# Altium project WorkLamp.PrjPCB
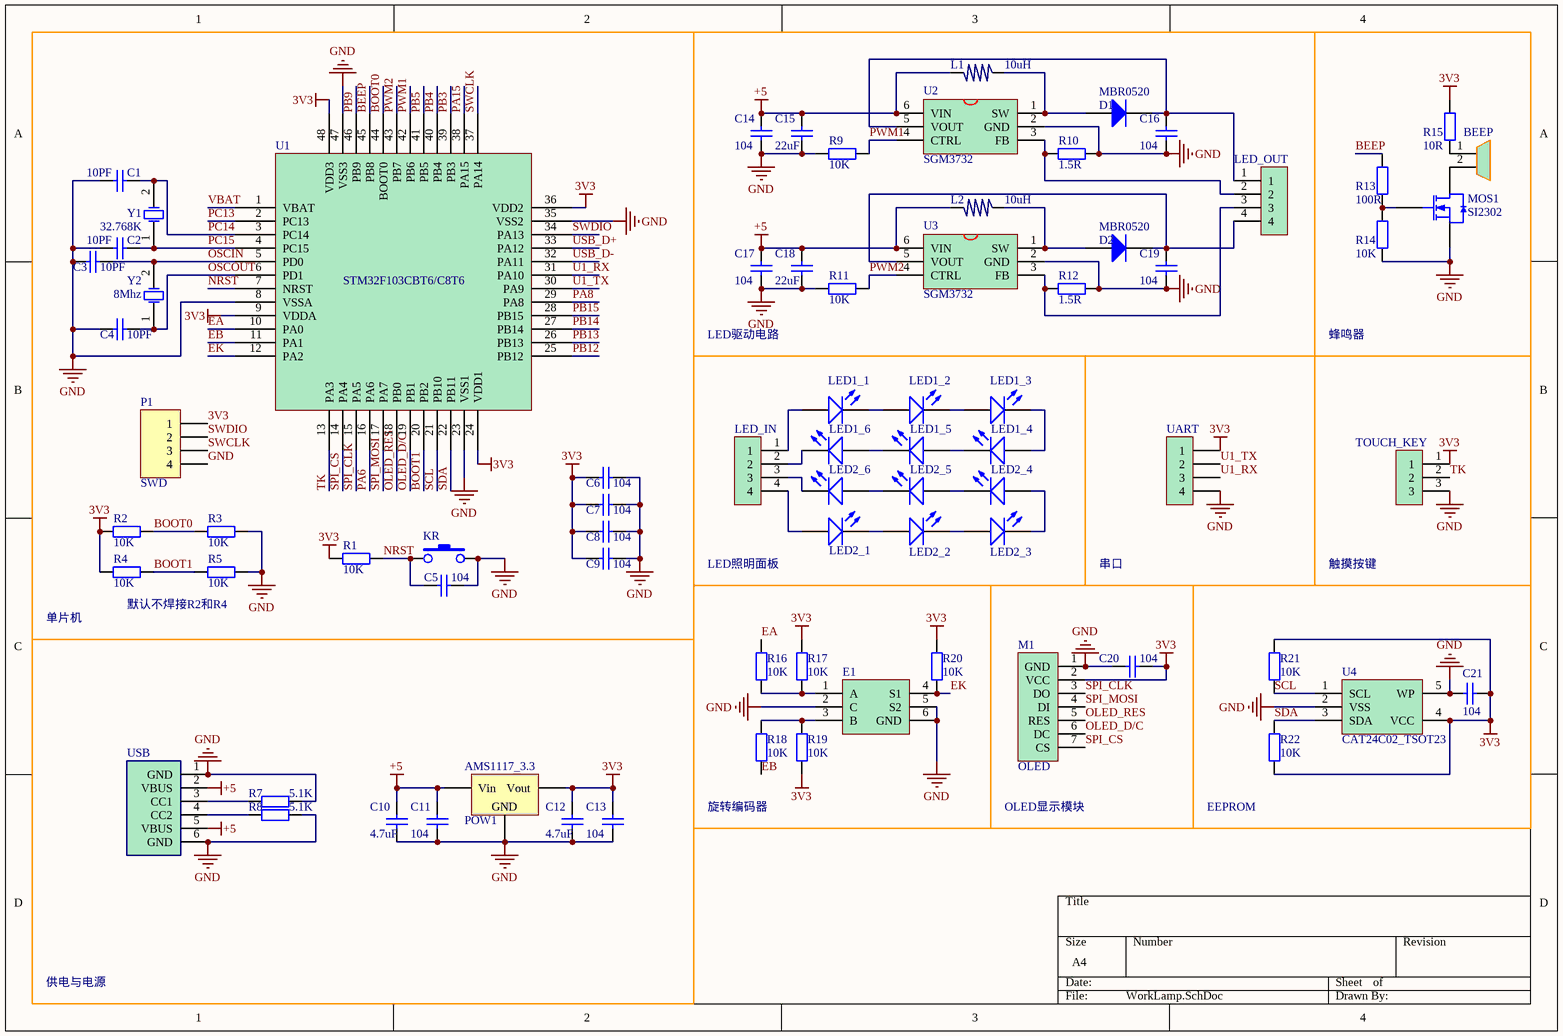
[diagram p0: WorkLamp.SchDoc]
1 sheet, 76 parts. Net scope: global (net labels, ports and power ports of the same name join across sheets).
Board files: WorkLamp.PcbDoc, WorkLamp_control.PcbDoc, WorkLamp_led.PcbDoc

## Sheet WorkLamp.SchDoc
size A4

### Parts
BEEP  BEEP_5020_SMT  [BEEP_5020_SMT]  (value not drawn)
C1  10PF  [0603_C]
C2  10PF  [0603_C]
C3  10PF  [0603_C]
C4  10PF  [0603_C]
C5  104  [0603_C]
C6  104  [0603_C]
C7  104  [0603_C]
C8  104  [0603_C]
C9  104  [0603_C]
C10  4.7uF  [0603_C]
C11  104  [0603_C]
C12  4.7uF  [0603_C]
C13  104  [0603_C]
C14  104  [0603_C]
C15  22uF  [0603_C]
C16  104  [0603_C]
C17  104  [0603_C]
C18  22uF  [0603_C]
C19  104  [0603_C]
C20  104  [0603_C]
C21  104  [0603_C]
D1  MBR0520  [SOD_123]
D2  MBR0520  [SOD_123]
E1  ENCODER  [ENCODER_EC11_DIP]  (value not drawn)
KR  KEY_SMT  [KEY_SMT]  (value not drawn)
L1  10uH  [0630_L]
L2  10uH  [0630_L]
LED1_1  LED_5730  [LED_5730]  (value not drawn)
LED1_2  LED_5730  [LED_5730]  (value not drawn)
LED1_3  LED_5730  [LED_5730]  (value not drawn)
LED1_4  LED_5730  [LED_5730]  (value not drawn)
LED1_5  LED_5730  [LED_5730]  (value not drawn)
LED1_6  LED_5730  [LED_5730]  (value not drawn)
LED2_1  LED_5730  [LED_5730]  (value not drawn)
LED2_2  LED_5730  [LED_5730]  (value not drawn)
LED2_3  LED_5730  [LED_5730]  (value not drawn)
LED2_4  LED_5730  [LED_5730]  (value not drawn)
LED2_5  LED_5730  [LED_5730]  (value not drawn)
LED2_6  LED_5730  [LED_5730]  (value not drawn)
LED_IN  SH1.25mm_4P  [SH1.25MM_4P]  (value not drawn)
LED_OUT  SH1.25mm_4P  [SH1.25MM_4P]  (value not drawn)
M1  OLED  [OLED_0.96_SPI]
MOS1  SI2302  [SOT23]
P1  SWD  [HDR1X4]
POW1  AMS1117_3.3  [SOT223]
R1  10K  [0603_R]
R2  10K  [0603_R]
R3  10K  [0603_R]
R4  10K  [0603_R]
R5  10K  [0603_R]
R7  5.1K  [0603_R]
R8  5.1K  [0603_R]
R9  10K  [0603_R]
R10  1.5R  [0603_R]
R11  10K  [0603_R]
R12  1.5R  [0603_R]
R13  100R  [0603_R]
R14  10K  [0603_R]
R15  10R  [0603_R]
R16  10K  [0603_R]
R17  10K  [0603_R]
R18  10K  [0603_R]
R19  10K  [0603_R]
R20  10K  [0603_R]
R21  10K  [0603_R]
R22  10K  [0603_R]
TOUCH_KEY  SH1.25mm_3P  [SH1.25mm_3P]  (value not drawn)
U1  STM32F103C8T6  [LQFP48]  (value not drawn)
U2  SGM3732  [TSOT_23_6]
U3  SGM3732  [TSOT_23_6]
U4  CAT24C02_TSOT23  [SOT_23_5]
UART  Header_2.54_4P  [HDR1_4P]  (value not drawn)
USB  USB_C_6P_SMT_S1  [USB_C_6PIN_SMT_S1]  (value not drawn)
Y1  32.768K  [XTAL_32.768_3215_2]
Y2  8Mhz  [XTAL_5032_2]

### Nets
3V3: C6.2 C7.2 C8.2 C9.2 C12.1 C13.1 C20.1 C21.1 M1.2(VCC) P1.1 POW1.2(Vout) R1.1 R2.2 R4.2 R15.1 R17.2 R19.1 R20.2 R21.2 R22.1 TOUCH_KEY.1 U1.9(VDDA) U1.24(VDD1) U1.36(VDD2) U1.48(VDD3) U4.4(VCC) UART.1
+5: C10.1 C11.1 C14.1 C15.1 C17.1 C18.1 L1.2 L2.2 POW1.3(Vin) U2.6(VIN) U3.6(VIN) USB.2(VBUS) USB.5(VBUS)
GND: C1.1 C2.1 C3.1 C4.1 C5.1 C6.1 C7.1 C8.1 C9.1 C10.2 C11.2 C12.2 C13.2 C14.2 C15.2 C16.2 C17.2 C18.2 C19.2 C20.2 C21.2 E1.2(C) E1.5(S2) E1.6(GND) KR.2 M1.1(GND) MOS1.2(S) P1.4 POW1.1(GND) R3.1 R5.1 R7.1 R8.1 R9.1 R10.1 R11.1 R12.1 R14.1 TOUCH_KEY.3 U1.8(VSSA) U1.23(VSS1) U1.35(VSS2) U1.47(VSS3) U2.2(GND) U3.2(GND) U4.2(VSS) U4.5(WP) UART.4 USB.1(GND) USB.6(GND)
BEEP: R13.2 U1.45(PB8)
BOOT0: R2.1 R3.2 U1.44(BOOT0)
BOOT1: R4.1 R5.2 U1.20(PB2)
EA: R16.2 U1.10(PA0)
EB: R18.1 U1.11(PA1)
EK: E1.4(S1) R20.1 U1.12(PA2)
NRST: C5.2 KR.1 R1.2 U1.7(NRST)
OLED_D/C: M1.6(DC) U1.19(PB1)
OLED_RES: M1.5(RES) U1.18(PB0)
OSCIN: C3.2 U1.5(PD0) Y2.2(OSC2)
OSCOUT: C4.2 U1.6(PD1) Y2.1(OSC1)
PA6: U1.16(PA6)
PA8: U1.29(PA8)
PA15: U1.38(PA15)
PB3: U1.39(PB3)
PB4: U1.40(PB4)
PB5: U1.41(PB5)
PB9: U1.46(PB9)
PB12: U1.25(PB12)
PB13: U1.26(PB13)
PB14: U1.27(PB14)
PB15: U1.28(PB15)
PC13: U1.2(PC13)
PC14: C1.2 U1.3(PC14) Y1.2(OSC2)
PC15: C2.2 U1.4(PC15) Y1.1(OSC1)
PWM1: R9.2 U1.42(PB6) U2.4(CTRL)
PWM2: R11.2 U1.43(PB7) U3.4(CTRL)
SCL: R21.1 U1.21(PB10) U4.1(SCL)
SDA: R22.2 U1.22(PB11) U4.3(SDA)
SPI_CLK: M1.3(DO) U1.15(PA5)
SPI_CS: M1.7(CS) U1.14(PA4)
SPI_MOSI: M1.4(DI) U1.17(PA7)
SWCLK: P1.3 U1.37(PA14)
SWDIO: P1.2 U1.34(PA13)
TK: TOUCH_KEY.2 U1.13(PA3)
U1_RX: U1.31(PA10) UART.3
U1_TX: U1.30(PA9) UART.2
USB_D+: U1.33(PA12)
USB_D-: U1.32(PA11)
VBAT: U1.1(VBAT)
NetBEEP_1: BEEP.1 R15.2
NetBEEP_2: BEEP.2 MOS1.3(D)
NetC16_1: C16.1 D1.2(K) LED_OUT.1 U2.5(VOUT)
NetC19_1: C19.1 D2.2(K) LED_OUT.4 U3.5(VOUT)
NetD1_1: D1.1(A) L1.1 U2.1(SW)
NetD2_1: D2.1(A) L2.1 U3.1(SW)
NetE1_1: E1.1(A) R16.1 R17.1
NetE1_3: E1.3(B) R18.2 R19.2
NetLED1_1_1: LED1_1.1(K) LED1_2.2(A)
NetLED1_1_2: LED1_1.2(A) LED_IN.1
NetLED1_2_1: LED1_2.1(K) LED1_3.2(A)
NetLED1_3_1: LED1_3.1(K) LED1_4.2(A)
NetLED1_4_1: LED1_4.1(K) LED1_5.2(A)
NetLED1_5_1: LED1_5.1(K) LED1_6.2(A)
NetLED1_6_1: LED1_6.1(K) LED_IN.2
NetLED2_1_1: LED2_1.1(K) LED2_2.2(A)
NetLED2_1_2: LED2_1.2(A) LED_IN.4
NetLED2_2_1: LED2_2.1(K) LED2_3.2(A)
NetLED2_3_1: LED2_3.1(K) LED2_4.2(A)
NetLED2_4_1: LED2_4.1(K) LED2_5.2(A)
NetLED2_5_1: LED2_5.1(K) LED2_6.2(A)
NetLED2_6_1: LED2_6.1(K) LED_IN.3
NetLED_OUT_2: LED_OUT.2 R10.2 U2.3(FB)
NetLED_OUT_3: LED_OUT.3 R12.2 U3.3(FB)
NetMOS1_1: MOS1.1(G) R13.1 R14.2
NetR7_2: R7.2 USB.3(CC1)
NetR8_2: R8.2 USB.4(CC2)

### Notes on the sheet
- LED驱动电路
- 蜂鸣器
- LED照明面板
- 串口
- 触摸按键
- 单片机
- 默认不焊接R2和R4
- (near R18) 旋转编码器
- OLED显示模块
- (near R22) EEPROM
- 供电与电源
- (in symbol STM32F103C8T6) STM32F103CBT6/C8T6

### Library data of the parts
C1-C21 = 0603_CAP
D1 D2 = SOD123_MBR0520
E1 = ENCODER_EC11_DIP
L1 L2 = 0630_L
LED1_1-LED1_6 LED2_1-LED2_6 = LED_5730: LED 5730
M1 = OLED_0.96_SPI
MOS1 = MOSN_SI2302_SOT23
P1 = Header 4: Header, 4-Pin; LatestRevisionDate: 17-Jul-2002; LatestRevisionNote: Re-released for DXP Platform.; Publisher: Altium Limited
R1-R5 R7-R22 = 0603_RES
U2 U3 = SGM3732: PWM Dimming, 38V Step-Up LED Driver
Y1 = XTAL_32.768_3215_2
Y2 = XTAL_8MHz_5032_2